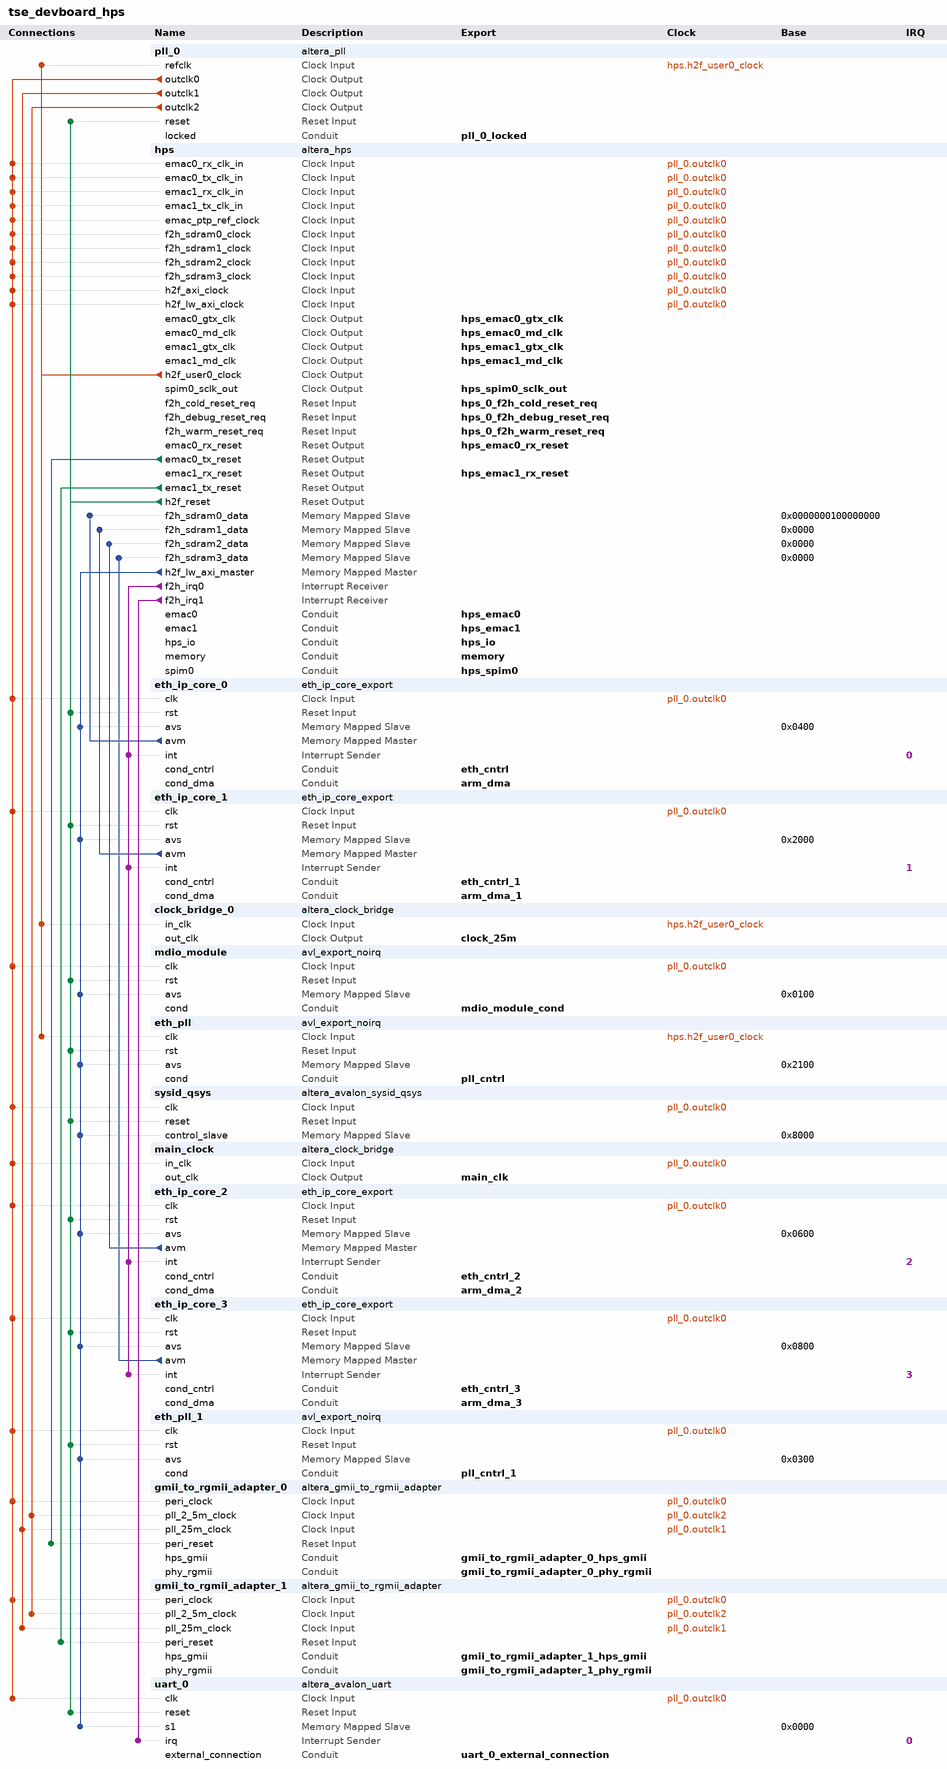
[diagram p0: system contents]
# Platform Designer (Qsys) system tse_devboard_hps, Cyclone V 5CSEBA6U23C8
# Parameters at their usual value, and those the tool derives, are not listed.
package require -exact qsys 18.1
create_system tse_devboard_hps
set_project_property DEVICE_FAMILY {Cyclone V}
set_project_property DEVICE 5CSEBA6U23C8

add_instance pll_0 altera_pll 18.1
set_instance_parameter_value pll_0 gui_device_speed_grade 2
set_instance_parameter_value pll_0 gui_number_of_clocks 3
set_instance_parameter_value pll_0 gui_operation_mode direct
set_instance_parameter_value pll_0 gui_output_clock_frequency0 125.0
set_instance_parameter_value pll_0 gui_output_clock_frequency1 25.0
set_instance_parameter_value pll_0 gui_output_clock_frequency2 2.5
set_instance_parameter_value pll_0 gui_phase_shift_deg1 20.0
set_instance_parameter_value pll_0 gui_pll_mode {Integer-N PLL}
set_instance_parameter_value pll_0 gui_ps_units0 degrees
set_instance_parameter_value pll_0 gui_ps_units1 degrees
set_instance_parameter_value pll_0 gui_ps_units2 degrees
set_instance_parameter_value pll_0 gui_reference_clock_frequency 25.0
set_instance_parameter_value pll_0 gui_use_locked true

add_instance hps altera_hps 18.1
set_instance_parameter_value hps DEVICE_DEPTH 2
set_instance_parameter_value hps EMAC0_Mode Full
set_instance_parameter_value hps EMAC0_PinMuxing FPGA
set_instance_parameter_value hps EMAC1_Mode Full
set_instance_parameter_value hps EMAC1_PinMuxing FPGA
set_instance_parameter_value hps F2SCLK_COLDRST_Enable true
set_instance_parameter_value hps F2SCLK_DBGRST_Enable true
set_instance_parameter_value hps F2SCLK_WARMRST_Enable true
set_instance_parameter_value hps F2SDRAM_Type {Avalon-MM Bidirectional,Avalon-MM Bidirectional,Avalon-MM Bidirectional,Avalon-MM Bidirectional}
set_instance_parameter_value hps F2SDRAM_Width 64,64,64,64
set_instance_parameter_value hps F2SINTERRUPT_Enable true
set_instance_parameter_value hps F2S_Width 0
set_instance_parameter_value hps FPGA_PERIPHERAL_OUTPUT_CLOCK_FREQ_EMAC0_GTX_CLK 100
set_instance_parameter_value hps FPGA_PERIPHERAL_OUTPUT_CLOCK_FREQ_EMAC0_MD_CLK 100.0
set_instance_parameter_value hps FPGA_PERIPHERAL_OUTPUT_CLOCK_FREQ_EMAC1_GTX_CLK 100
set_instance_parameter_value hps FPGA_PERIPHERAL_OUTPUT_CLOCK_FREQ_EMAC1_MD_CLK 100.0
set_instance_parameter_value hps HPS_PROTOCOL DDR3
set_instance_parameter_value hps I2C0_Mode I2C
set_instance_parameter_value hps I2C0_PinMuxing {HPS I/O Set 0}
set_instance_parameter_value hps I2C1_Mode I2C
set_instance_parameter_value hps I2C1_PinMuxing {HPS I/O Set 1}
set_instance_parameter_value hps LWH2F_Enable true
set_instance_parameter_value hps MEM_BANKADDR_WIDTH 3
set_instance_parameter_value hps MEM_CLK_FREQ 400.0
set_instance_parameter_value hps MEM_COL_ADDR_WIDTH 10
set_instance_parameter_value hps MEM_DQ_WIDTH 32
set_instance_parameter_value hps MEM_DRV_STR RZQ/7
set_instance_parameter_value hps MEM_ROW_ADDR_WIDTH 16
set_instance_parameter_value hps MEM_RTT_NOM RZQ/4
set_instance_parameter_value hps MEM_RTT_WR {Dynamic ODT off}
set_instance_parameter_value hps MEM_TCL 7
set_instance_parameter_value hps MEM_TFAW_NS 30.0
set_instance_parameter_value hps MEM_TRAS_NS 35.0
set_instance_parameter_value hps MEM_TRCD_NS 13.75
set_instance_parameter_value hps MEM_TRFC_NS 260.0
set_instance_parameter_value hps MEM_TRP_NS 13.75
set_instance_parameter_value hps MEM_TRRD_NS 10.0
set_instance_parameter_value hps MEM_TRTP_NS 10.0
set_instance_parameter_value hps MEM_VENDOR JEDEC
set_instance_parameter_value hps MEM_VOLTAGE {1.35V DDR3L}
set_instance_parameter_value hps MEM_WTCL 6
set_instance_parameter_value hps NAND_Mode {ONFI 1.0}
set_instance_parameter_value hps NAND_PinMuxing {HPS I/O Set 0}
set_instance_parameter_value hps QSPI_Mode {1 SS}
set_instance_parameter_value hps QSPI_PinMuxing {HPS I/O Set 0}
set_instance_parameter_value hps REF_CLK_FREQ 25.0
set_instance_parameter_value hps S2FCLK_USER0CLK_Enable true
set_instance_parameter_value hps S2FCLK_USER2CLK 5
set_instance_parameter_value hps S2F_Width 1
set_instance_parameter_value hps SDIO_Mode {8-bit Data}
set_instance_parameter_value hps SDIO_PinMuxing {HPS I/O Set 0}
set_instance_parameter_value hps SPIM0_Mode Full
set_instance_parameter_value hps SPIM0_PinMuxing FPGA
set_instance_parameter_value hps SPIM1_Mode N/A
set_instance_parameter_value hps SPIM1_PinMuxing Unused
set_instance_parameter_value hps STM_Enable false
set_instance_parameter_value hps TIMING_BOARD_AC_SKEW 0.0
set_instance_parameter_value hps TIMING_BOARD_AC_TO_CK_SKEW 0.0
set_instance_parameter_value hps TIMING_BOARD_DQ_TO_DQS_SKEW 0.0
set_instance_parameter_value hps TIMING_BOARD_MAX_CK_DELAY 0.6
set_instance_parameter_value hps TIMING_BOARD_MAX_DQS_DELAY 0.2
set_instance_parameter_value hps TIMING_BOARD_SKEW_BETWEEN_DQS 0.01
set_instance_parameter_value hps TIMING_BOARD_SKEW_CKDQS_DIMM_MAX 0.215
set_instance_parameter_value hps TIMING_BOARD_SKEW_CKDQS_DIMM_MIN 0.092
set_instance_parameter_value hps TIMING_BOARD_SKEW_WITHIN_DQS 0.0
set_instance_parameter_value hps TIMING_TDH 45
set_instance_parameter_value hps TIMING_TDQSCK 225
set_instance_parameter_value hps TIMING_TDQSQ 100
set_instance_parameter_value hps TIMING_TDQSS 0.27
set_instance_parameter_value hps TIMING_TDS 10
set_instance_parameter_value hps TIMING_TDSH 0.18
set_instance_parameter_value hps TIMING_TDSS 0.18
set_instance_parameter_value hps TIMING_TIH 120
set_instance_parameter_value hps TIMING_TIS 170
set_instance_parameter_value hps TIMING_TQSH 0.4
set_instance_parameter_value hps UART0_Mode {No Flow Control}
set_instance_parameter_value hps UART0_PinMuxing {HPS I/O Set 0}
set_instance_parameter_value hps UART1_Mode {Flow Control}
set_instance_parameter_value hps UART1_PinMuxing {HPS I/O Set 0}
set_instance_parameter_value hps USB1_Mode SDR
set_instance_parameter_value hps USB1_PinMuxing {HPS I/O Set 0}
set_instance_parameter_value hps desired_cfg_clk_mhz 25.0
set_instance_parameter_value hps desired_mpu_clk_mhz 600.0
set_instance_parameter_value hps desired_nand_clk_mhz 100.0
set_instance_parameter_value hps desired_qspi_clk_mhz 400.0
set_instance_parameter_value hps desired_sdmmc_clk_mhz 100.0

add_instance eth_ip_core_0 eth_ip_core_export 1.0
set_instance_parameter_value eth_ip_core_0 pADDR_CNTRL_WIDTH 6
set_instance_parameter_value eth_ip_core_0 pADDR_TIMEST_WIDTH 10
set_instance_parameter_value eth_ip_core_0 pDATA_WIDTH 32

add_instance eth_ip_core_1 eth_ip_core_export 1.0
set_instance_parameter_value eth_ip_core_1 pADDR_CNTRL_WIDTH 6
set_instance_parameter_value eth_ip_core_1 pADDR_TIMEST_WIDTH 10
set_instance_parameter_value eth_ip_core_1 pDATA_WIDTH 32

add_instance clock_bridge_0 altera_clock_bridge 18.1
set_instance_parameter_value clock_bridge_0 DERIVED_CLOCK_RATE 25000000
set_instance_parameter_value clock_bridge_0 EXPLICIT_CLOCK_RATE 25000000

add_instance mdio_module avl_export_noirq 1.0
set_instance_parameter_value mdio_module pADDR_WIDTH 6
set_instance_parameter_value mdio_module pDATA_WIDTH 32

add_instance eth_pll avl_export_noirq 1.0
set_instance_parameter_value eth_pll pADDR_WIDTH 6
set_instance_parameter_value eth_pll pDATA_WIDTH 32

add_instance sysid_qsys altera_avalon_sysid_qsys 18.1
set_instance_parameter_value sysid_qsys id -559038737

add_instance main_clock altera_clock_bridge 18.1
set_instance_parameter_value main_clock DERIVED_CLOCK_RATE 125000000
set_instance_parameter_value main_clock EXPLICIT_CLOCK_RATE 125000000

add_instance eth_ip_core_2 eth_ip_core_export 1.0
set_instance_parameter_value eth_ip_core_2 pADDR_CNTRL_WIDTH 6
set_instance_parameter_value eth_ip_core_2 pADDR_TIMEST_WIDTH 10
set_instance_parameter_value eth_ip_core_2 pDATA_WIDTH 32

add_instance eth_ip_core_3 eth_ip_core_export 1.0
set_instance_parameter_value eth_ip_core_3 pADDR_CNTRL_WIDTH 6
set_instance_parameter_value eth_ip_core_3 pADDR_TIMEST_WIDTH 10
set_instance_parameter_value eth_ip_core_3 pDATA_WIDTH 32

add_instance eth_pll_1 avl_export_noirq 1.0
set_instance_parameter_value eth_pll_1 pADDR_WIDTH 6
set_instance_parameter_value eth_pll_1 pDATA_WIDTH 32

add_instance gmii_to_rgmii_adapter_0 altera_gmii_to_rgmii_adapter 18.1
set_instance_parameter_value gmii_to_rgmii_adapter_0 RX_PIPELINE_DEPTH 0
set_instance_parameter_value gmii_to_rgmii_adapter_0 TX_PIPELINE_DEPTH 0

add_instance gmii_to_rgmii_adapter_1 altera_gmii_to_rgmii_adapter 18.1
set_instance_parameter_value gmii_to_rgmii_adapter_1 RX_PIPELINE_DEPTH 0
set_instance_parameter_value gmii_to_rgmii_adapter_1 TX_PIPELINE_DEPTH 0

add_instance uart_0 altera_avalon_uart 18.1
set_instance_parameter_value uart_0 baud 115200
set_instance_parameter_value uart_0 dataBits 8
set_instance_parameter_value uart_0 fixedBaud true
set_instance_parameter_value uart_0 parity NONE
set_instance_parameter_value uart_0 stopBits 1
set_instance_parameter_value uart_0 useCtsRts true

# connections
add_connection hps.h2f_user0_clock clock_bridge_0.in_clk clock
add_connection hps.h2f_user0_clock eth_pll.clk clock
add_connection hps.h2f_user0_clock pll_0.refclk clock
add_connection pll_0.outclk0 eth_ip_core_0.clk clock
add_connection pll_0.outclk0 eth_ip_core_1.clk clock
add_connection pll_0.outclk0 eth_ip_core_2.clk clock
add_connection pll_0.outclk0 eth_ip_core_3.clk clock
add_connection pll_0.outclk0 eth_pll_1.clk clock
add_connection pll_0.outclk0 gmii_to_rgmii_adapter_0.peri_clock clock
add_connection pll_0.outclk0 gmii_to_rgmii_adapter_1.peri_clock clock
add_connection pll_0.outclk0 hps.emac0_rx_clk_in clock
add_connection pll_0.outclk0 hps.emac0_tx_clk_in clock
add_connection pll_0.outclk0 hps.emac1_rx_clk_in clock
add_connection pll_0.outclk0 hps.emac1_tx_clk_in clock
add_connection pll_0.outclk0 hps.emac_ptp_ref_clock clock
add_connection pll_0.outclk0 hps.f2h_sdram0_clock clock
add_connection pll_0.outclk0 hps.f2h_sdram1_clock clock
add_connection pll_0.outclk0 hps.f2h_sdram2_clock clock
add_connection pll_0.outclk0 hps.f2h_sdram3_clock clock
add_connection pll_0.outclk0 hps.h2f_axi_clock clock
add_connection pll_0.outclk0 hps.h2f_lw_axi_clock clock
add_connection pll_0.outclk0 main_clock.in_clk clock
add_connection pll_0.outclk0 mdio_module.clk clock
add_connection pll_0.outclk0 sysid_qsys.clk clock
add_connection pll_0.outclk0 uart_0.clk clock
add_connection pll_0.outclk1 gmii_to_rgmii_adapter_0.pll_25m_clock clock
add_connection pll_0.outclk1 gmii_to_rgmii_adapter_1.pll_25m_clock clock
add_connection pll_0.outclk2 gmii_to_rgmii_adapter_0.pll_2_5m_clock clock
add_connection pll_0.outclk2 gmii_to_rgmii_adapter_1.pll_2_5m_clock clock
add_connection hps.emac0_tx_reset gmii_to_rgmii_adapter_0.peri_reset reset
add_connection hps.emac1_tx_reset gmii_to_rgmii_adapter_1.peri_reset reset
add_connection hps.h2f_reset eth_ip_core_0.rst reset
add_connection hps.h2f_reset eth_ip_core_1.rst reset
add_connection hps.h2f_reset eth_ip_core_2.rst reset
add_connection hps.h2f_reset eth_ip_core_3.rst reset
add_connection hps.h2f_reset eth_pll.rst reset
add_connection hps.h2f_reset eth_pll_1.rst reset
add_connection hps.h2f_reset mdio_module.rst reset
add_connection hps.h2f_reset pll_0.reset reset
add_connection hps.h2f_reset sysid_qsys.reset reset
add_connection hps.h2f_reset uart_0.reset reset
add_connection eth_ip_core_0.avm hps.f2h_sdram0_data avalon
set_connection_parameter_value eth_ip_core_0.avm/hps.f2h_sdram0_data baseAddress 0x0000000100000000
add_connection eth_ip_core_1.avm hps.f2h_sdram1_data avalon
set_connection_parameter_value eth_ip_core_1.avm/hps.f2h_sdram1_data baseAddress 0x0000
add_connection eth_ip_core_2.avm hps.f2h_sdram2_data avalon
set_connection_parameter_value eth_ip_core_2.avm/hps.f2h_sdram2_data baseAddress 0x0000
add_connection eth_ip_core_3.avm hps.f2h_sdram3_data avalon
set_connection_parameter_value eth_ip_core_3.avm/hps.f2h_sdram3_data baseAddress 0x0000
add_connection hps.h2f_lw_axi_master eth_ip_core_0.avs avalon
set_connection_parameter_value hps.h2f_lw_axi_master/eth_ip_core_0.avs baseAddress 0x0400
add_connection hps.h2f_lw_axi_master eth_ip_core_1.avs avalon
set_connection_parameter_value hps.h2f_lw_axi_master/eth_ip_core_1.avs baseAddress 0x2000
add_connection hps.h2f_lw_axi_master eth_ip_core_2.avs avalon
set_connection_parameter_value hps.h2f_lw_axi_master/eth_ip_core_2.avs baseAddress 0x0600
add_connection hps.h2f_lw_axi_master eth_ip_core_3.avs avalon
set_connection_parameter_value hps.h2f_lw_axi_master/eth_ip_core_3.avs baseAddress 0x0800
add_connection hps.h2f_lw_axi_master eth_pll.avs avalon
set_connection_parameter_value hps.h2f_lw_axi_master/eth_pll.avs baseAddress 0x2100
add_connection hps.h2f_lw_axi_master eth_pll_1.avs avalon
set_connection_parameter_value hps.h2f_lw_axi_master/eth_pll_1.avs baseAddress 0x0300
add_connection hps.h2f_lw_axi_master mdio_module.avs avalon
set_connection_parameter_value hps.h2f_lw_axi_master/mdio_module.avs baseAddress 0x0100
add_connection hps.h2f_lw_axi_master sysid_qsys.control_slave avalon
set_connection_parameter_value hps.h2f_lw_axi_master/sysid_qsys.control_slave baseAddress 0x8000
add_connection hps.h2f_lw_axi_master uart_0.s1 avalon
set_connection_parameter_value hps.h2f_lw_axi_master/uart_0.s1 baseAddress 0x0000
add_connection hps.f2h_irq0 eth_ip_core_0.int interrupt
set_connection_parameter_value hps.f2h_irq0/eth_ip_core_0.int irqNumber 0
add_connection hps.f2h_irq0 eth_ip_core_1.int interrupt
set_connection_parameter_value hps.f2h_irq0/eth_ip_core_1.int irqNumber 1
add_connection hps.f2h_irq0 eth_ip_core_2.int interrupt
set_connection_parameter_value hps.f2h_irq0/eth_ip_core_2.int irqNumber 2
add_connection hps.f2h_irq0 eth_ip_core_3.int interrupt
set_connection_parameter_value hps.f2h_irq0/eth_ip_core_3.int irqNumber 3
add_connection hps.f2h_irq1 uart_0.irq interrupt
set_connection_parameter_value hps.f2h_irq1/uart_0.irq irqNumber 0

# exported interfaces
add_interface arm_dma conduit end
set_interface_property arm_dma EXPORT_OF eth_ip_core_0.cond_dma
add_interface arm_dma_1 conduit end
set_interface_property arm_dma_1 EXPORT_OF eth_ip_core_1.cond_dma
add_interface arm_dma_2 conduit end
set_interface_property arm_dma_2 EXPORT_OF eth_ip_core_2.cond_dma
add_interface arm_dma_3 conduit end
set_interface_property arm_dma_3 EXPORT_OF eth_ip_core_3.cond_dma
add_interface clock_25m clock source
set_interface_property clock_25m EXPORT_OF clock_bridge_0.out_clk
add_interface eth_cntrl conduit end
set_interface_property eth_cntrl EXPORT_OF eth_ip_core_0.cond_cntrl
add_interface eth_cntrl_1 conduit end
set_interface_property eth_cntrl_1 EXPORT_OF eth_ip_core_1.cond_cntrl
add_interface eth_cntrl_2 conduit end
set_interface_property eth_cntrl_2 EXPORT_OF eth_ip_core_2.cond_cntrl
add_interface eth_cntrl_3 conduit end
set_interface_property eth_cntrl_3 EXPORT_OF eth_ip_core_3.cond_cntrl
add_interface gmii_to_rgmii_adapter_0_hps_gmii conduit end
set_interface_property gmii_to_rgmii_adapter_0_hps_gmii EXPORT_OF gmii_to_rgmii_adapter_0.hps_gmii
add_interface gmii_to_rgmii_adapter_0_phy_rgmii conduit end
set_interface_property gmii_to_rgmii_adapter_0_phy_rgmii EXPORT_OF gmii_to_rgmii_adapter_0.phy_rgmii
add_interface gmii_to_rgmii_adapter_1_hps_gmii conduit end
set_interface_property gmii_to_rgmii_adapter_1_hps_gmii EXPORT_OF gmii_to_rgmii_adapter_1.hps_gmii
add_interface gmii_to_rgmii_adapter_1_phy_rgmii conduit end
set_interface_property gmii_to_rgmii_adapter_1_phy_rgmii EXPORT_OF gmii_to_rgmii_adapter_1.phy_rgmii
add_interface hps_0_f2h_cold_reset_req reset sink
set_interface_property hps_0_f2h_cold_reset_req EXPORT_OF hps.f2h_cold_reset_req
add_interface hps_0_f2h_debug_reset_req reset sink
set_interface_property hps_0_f2h_debug_reset_req EXPORT_OF hps.f2h_debug_reset_req
add_interface hps_0_f2h_warm_reset_req reset sink
set_interface_property hps_0_f2h_warm_reset_req EXPORT_OF hps.f2h_warm_reset_req
add_interface hps_emac0 conduit end
set_interface_property hps_emac0 EXPORT_OF hps.emac0
add_interface hps_emac0_gtx_clk clock source
set_interface_property hps_emac0_gtx_clk EXPORT_OF hps.emac0_gtx_clk
add_interface hps_emac0_md_clk clock source
set_interface_property hps_emac0_md_clk EXPORT_OF hps.emac0_md_clk
add_interface hps_emac0_rx_reset reset source
set_interface_property hps_emac0_rx_reset EXPORT_OF hps.emac0_rx_reset
add_interface hps_emac1 conduit end
set_interface_property hps_emac1 EXPORT_OF hps.emac1
add_interface hps_emac1_gtx_clk clock source
set_interface_property hps_emac1_gtx_clk EXPORT_OF hps.emac1_gtx_clk
add_interface hps_emac1_md_clk clock source
set_interface_property hps_emac1_md_clk EXPORT_OF hps.emac1_md_clk
add_interface hps_emac1_rx_reset reset source
set_interface_property hps_emac1_rx_reset EXPORT_OF hps.emac1_rx_reset
add_interface hps_io conduit end
set_interface_property hps_io EXPORT_OF hps.hps_io
add_interface hps_spim0 conduit end
set_interface_property hps_spim0 EXPORT_OF hps.spim0
add_interface hps_spim0_sclk_out clock source
set_interface_property hps_spim0_sclk_out EXPORT_OF hps.spim0_sclk_out
add_interface main_clk clock source
set_interface_property main_clk EXPORT_OF main_clock.out_clk
add_interface mdio_module_cond conduit end
set_interface_property mdio_module_cond EXPORT_OF mdio_module.cond
add_interface memory conduit end
set_interface_property memory EXPORT_OF hps.memory
add_interface pll_0_locked conduit end
set_interface_property pll_0_locked EXPORT_OF pll_0.locked
add_interface pll_cntrl conduit end
set_interface_property pll_cntrl EXPORT_OF eth_pll.cond
add_interface pll_cntrl_1 conduit end
set_interface_property pll_cntrl_1 EXPORT_OF eth_pll_1.cond
add_interface uart_0_external_connection conduit end
set_interface_property uart_0_external_connection EXPORT_OF uart_0.external_connection

set_interconnect_requirement {$system} qsys_mm.clockCrossingAdapter HANDSHAKE
set_interconnect_requirement {$system} qsys_mm.insertDefaultSlave FALSE
set_interconnect_requirement {$system} qsys_mm.maxAdditionalLatency 1

save_system tse_devboard_hps.qsys
